# Altium project Kasil_DIOT_x86_board.PrjPcb (part 2 of 4)

## Sheet DualETH_CON.SchDoc
size 420 x 297 mm; SheetNumber: 7; SheetTotal: 11; ModifiedBy: -; CheckedDate: -; Title2: Title 2; DivGrp: WUT ISE; Designer: G.Kasprowicz
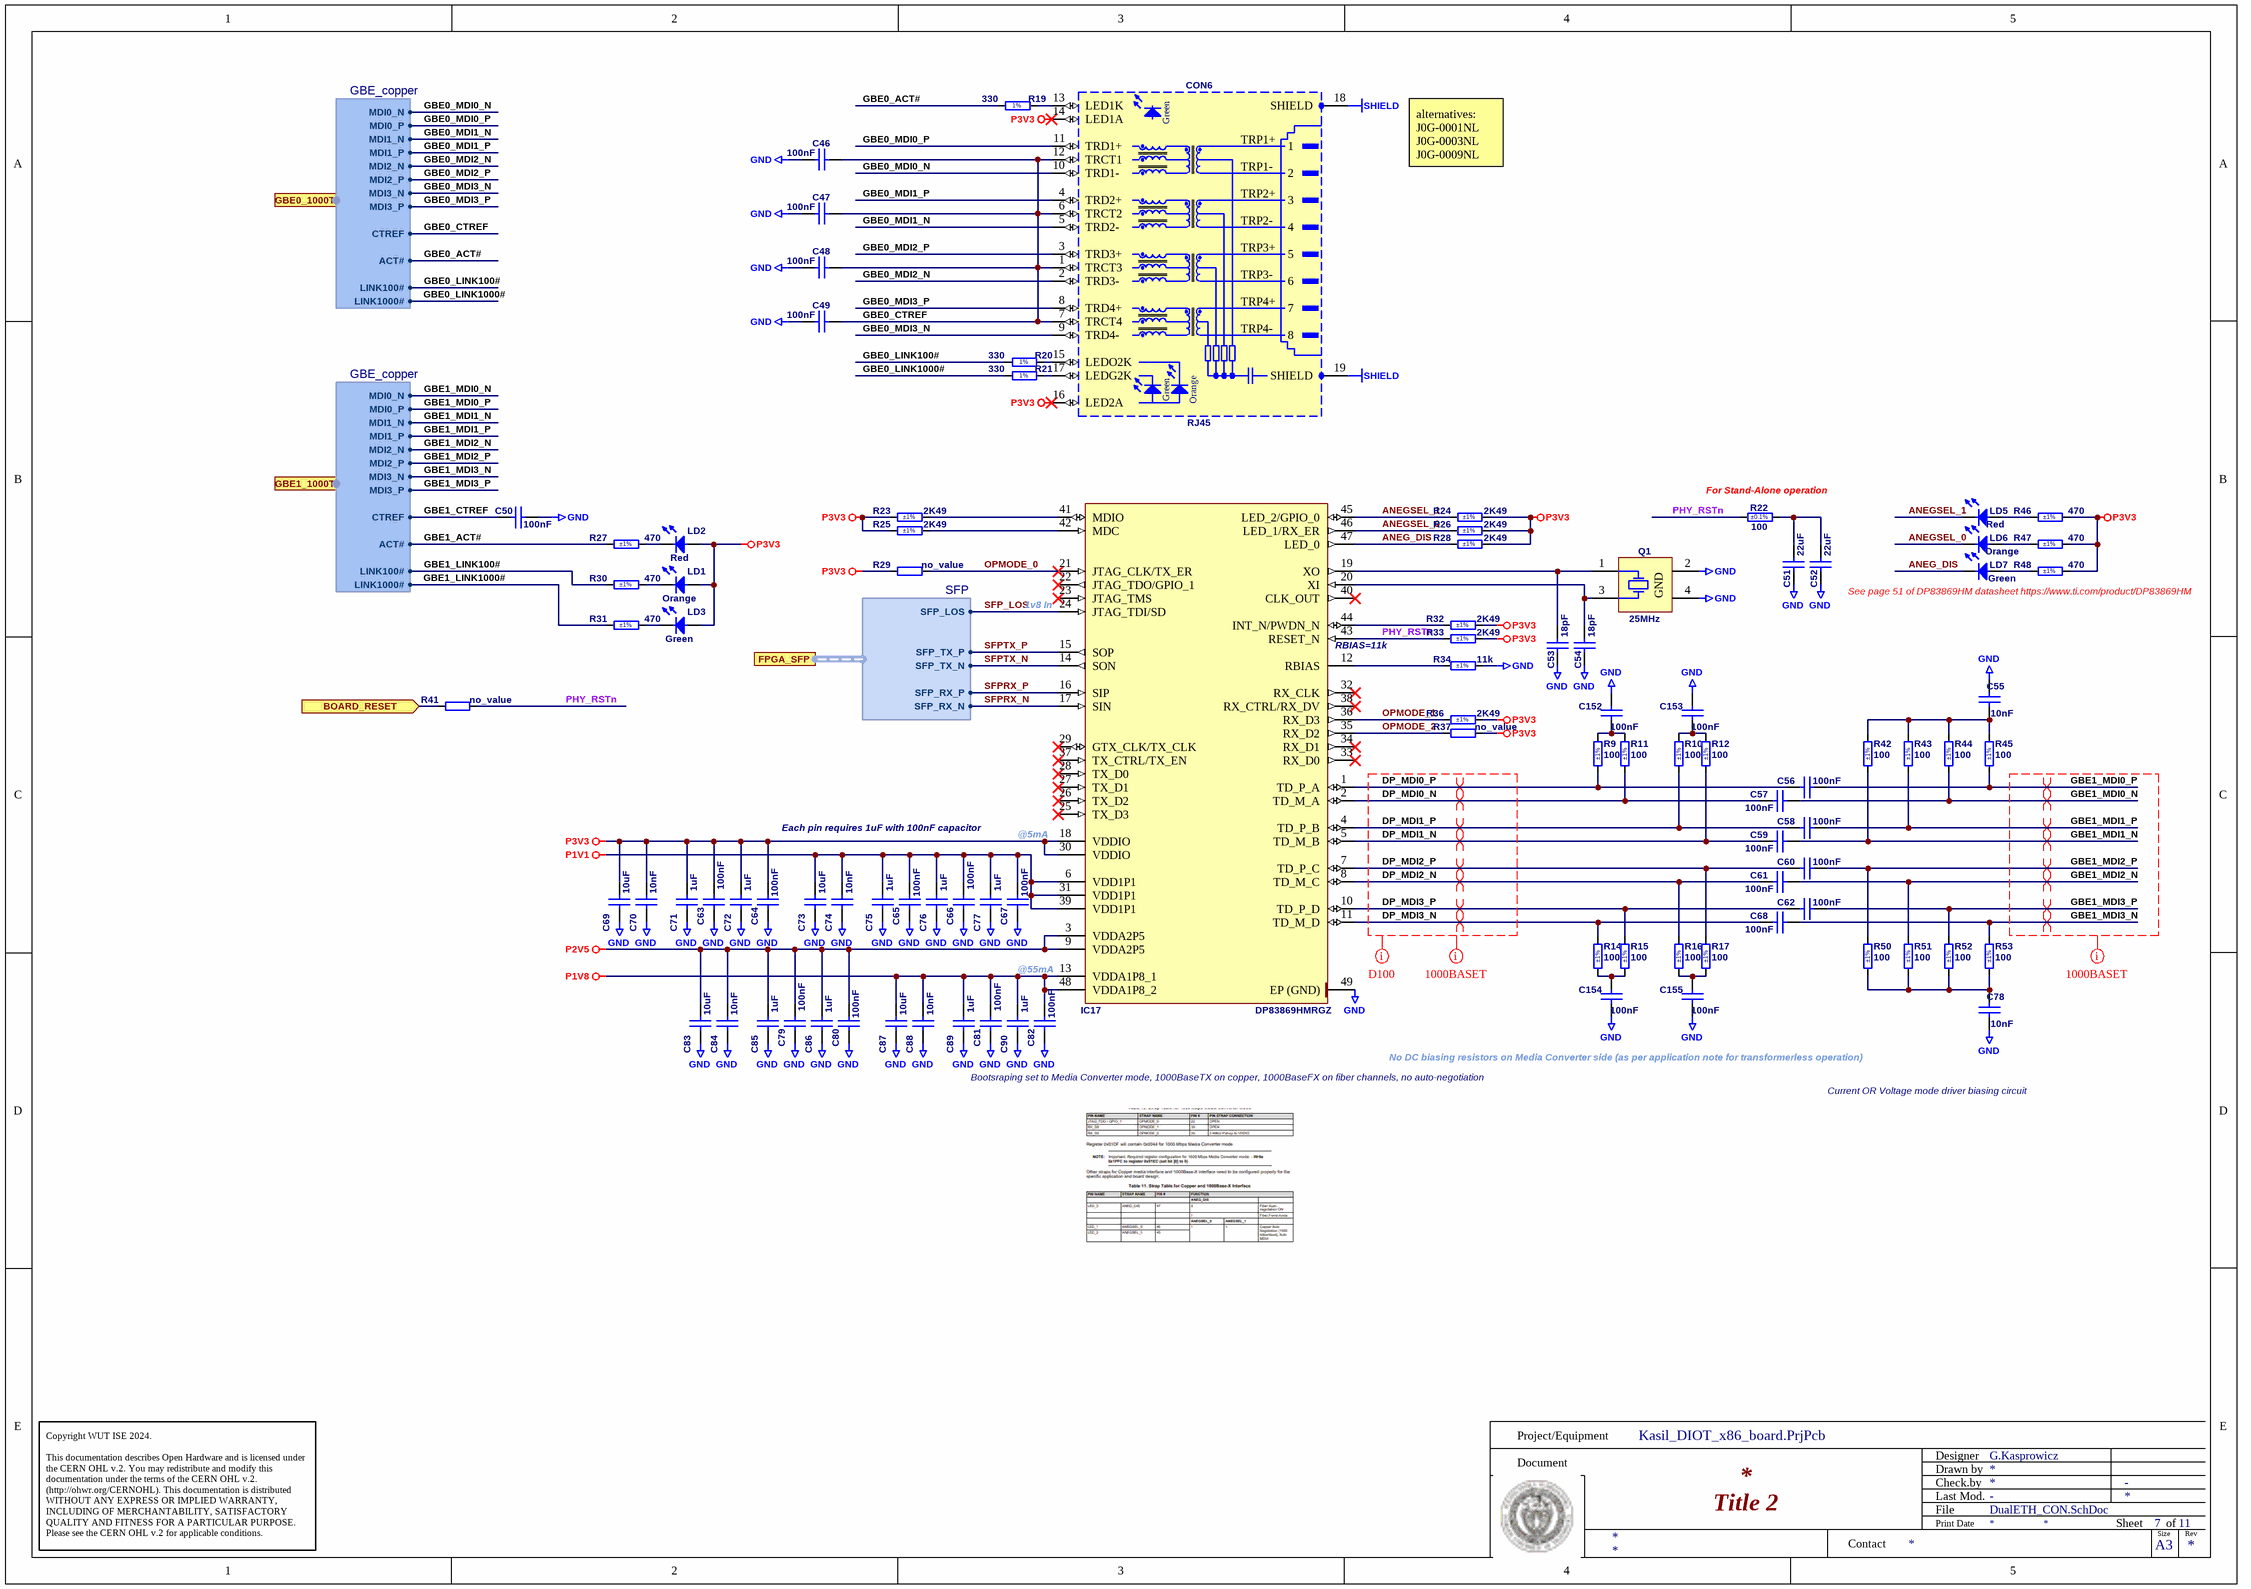
[diagram p3: DualETH_CON.SchDoc]

### Parts
C46  100nF  [CAPC1005X55N]
C47  100nF  [CAPC1005X55N]
C48  100nF  [CAPC1005X55N]
C49  100nF  [CAPC1005X55N]
C50  100nF  [CAPC1005X55N]
C51  22uF  [CAPC2012X135N]
C52  22uF  [CAPC2012X135N]
C53  18pF  [CAPC1005X55N]
C54  18pF  [CAPC1005X55N]
C55  10nF  [CAPC1005X55N]
C56  100nF  [CAPC1005X55N]
C57  100nF  [CAPC1005X55N]
C58  100nF  [CAPC1005X55N]
C59  100nF  [CAPC1005X55N]
C60  100nF  [CAPC1005X55N]
C61  100nF  [CAPC1005X55N]
C62  100nF  [CAPC1005X55N]
C63  100nF  [CAPC1005X55N]
C64  100nF  [CAPC1005X55N]
C65  100nF  [CAPC1005X55N]
C66  100nF  [CAPC1005X55N]
C67  100nF  [CAPC1005X55N]
C68  100nF  [CAPC1005X55N]
C69  10uF  [CAPC1608X80N]
C70  10nF  [CAPC1005X55N]
C71  1uF  [CAPC1005X55N]
C72  1uF  [CAPC1005X55N]
C73  10uF  [CAPC1608X80N]
C74  10nF  [CAPC1005X55N]
C75  1uF  [CAPC1005X55N]
C76  1uF  [CAPC1005X55N]
C77  1uF  [CAPC1005X55N]
C78  10nF  [CAPC1005X55N]
C79  100nF  [CAPC1005X55N]
C80  100nF  [CAPC1005X55N]
C81  100nF  [CAPC1005X55N]
C82  100nF  [CAPC1005X55N]
C83  10uF  [CAPC1608X80N]
C84  10nF  [CAPC1005X55N]
C85  1uF  [CAPC1005X55N]
C86  1uF  [CAPC1005X55N]
C87  10uF  [CAPC1608X80N]
C88  10nF  [CAPC1005X55N]
C89  1uF  [CAPC1005X55N]
C90  1uF  [CAPC1005X55N]
C152  100nF  [CAPC1005X55N]
C153  100nF  [CAPC1005X55N]
C154  100nF  [CAPC1005X55N]
C155  100nF  [CAPC1005X55N]
CON6  RJ45  [BELFUSE_L829-1J1T-43]
IC17  DP83869HMRGZ  [QFN50P700X700X100-49N-S420]
LD1  Orange  [LED_DIALIGHT_597-2111-407F]
LD2  Red  [LED_DIALIGHT_597-2111-407F]
LD3  Green  [LED_DIALIGHT_597-2111-407F]
LD5  Red  [LED_DIALIGHT_597-2111-407F]
LD6  Orange  [LED_DIALIGHT_597-2111-407F]
LD7  Green  [LED_DIALIGHT_597-2111-407F]
Q1  25MHz  [XTAL_EPSON_TSX-3225]
R9  100  Tolerance: ±1%  [RESC1005X40N]
R10  100  Tolerance: ±1%  [RESC1005X40N]
R11  100  Tolerance: ±1%  [RESC1005X40N]
R12  100  Tolerance: ±1%  [RESC1005X40N]
R14  100  Tolerance: ±1%  [RESC1005X40N]
R15  100  Tolerance: ±1%  [RESC1005X40N]
R16  100  Tolerance: ±1%  [RESC1005X40N]
R17  100  Tolerance: ±1%  [RESC1005X40N]
R19  330  [RESC1608X55N]
R20  330  [RESC1608X55N]
R21  330  [RESC1608X55N]
R22  100  Tolerance: ±0.1%  [RESC1005X35N]
R23  2K49  Tolerance: ±1%  [RESC1005X40N]
R24  2K49  Tolerance: ±1%  [RESC1005X40N]
R25  2K49  Tolerance: ±1%  [RESC1005X40N]
R26  2K49  Tolerance: ±1%  [RESC1005X40N]
R27  470  Tolerance: ±1%  [RESC1005X40N]
R28  2K49  Tolerance: ±1%  [RESC1005X40N]
R29  no_value  [RESC1005X40N]  (no BOM)
R30  470  Tolerance: ±1%  [RESC1005X40N]
R31  470  Tolerance: ±1%  [RESC1005X40N]
R32  2K49  Tolerance: ±1%  [RESC1005X40N]
R33  2K49  Tolerance: ±1%  [RESC1005X40N]
R34  11k  Tolerance: ±1%  [RESC1005X40N]
R36  2K49  Tolerance: ±1%  [RESC1005X40N]
R37  no_value  [RESC1005X40N]  (no BOM)
R41  no_value  [RESC1005X40N]  (no BOM)
R42  100  Tolerance: ±1%  [RESC1005X40N]
R43  100  Tolerance: ±1%  [RESC1005X40N]
R44  100  Tolerance: ±1%  [RESC1005X40N]
R45  100  Tolerance: ±1%  [RESC1005X40N]
R46  470  Tolerance: ±1%  [RESC1005X40N]
R47  470  Tolerance: ±1%  [RESC1005X40N]
R48  470  Tolerance: ±1%  [RESC1005X40N]
R50  100  Tolerance: ±1%  [RESC1005X40N]
R51  100  Tolerance: ±1%  [RESC1005X40N]
R52  100  Tolerance: ±1%  [RESC1005X40N]
R53  100  Tolerance: ±1%  [RESC1005X40N]

### Ports
BOARD_RESET (in), FPGA_SFP (harness SFP), GBE0_1000T (harness GBE_copper), GBE1_1000T (harness GBE_copper)

### Harnesses
GBE_copper: MDI2_P, MDI3_N, MDI2_N, MDI3_P, MDI1_P, MDI0_N, MDI1_N, MDI0_P, ACT#, LINK100#, LINK1000#, CTREF
SFP: SFP_TX_P, SFP_TX_N, SFP_RX_P, SFP_RX_N, SFP_LOS

### Nets
GND: C46.1 C47.1 C48.1 C49.1 C50.1 C51.1 C52.1 C53.1 C54.1 C55.2 C63.1 C64.1 C65.1 C66.1 C67.1 C69.1 C70.1 C71.1 C72.1 C73.1 C74.1 C75.1 C76.1 C77.1 C78.1 C79.1 C80.1 C81.1 C82.1 C83.1 C84.1 C85.1 C86.1 C87.1 C88.1 C89.1 C90.1 C152.2 C153.2 C154.1 C155.1 IC17.49(EP_(GND)) Q1.2(GND) Q1.4(GND) R34.2
P1V1: C65.2 C66.2 C67.2 C73.2 C74.2 C75.2 C76.2 C77.2 IC17.6(VDD1P1) IC17.31(VDD1P1) IC17.39(VDD1P1)
P1V8: C81.2 C82.2 C87.2 C88.2 C89.2 C90.2 IC17.13(VDDA1P8_1) IC17.48(VDDA1P8_2)
P2V5: C79.2 C80.2 C83.2 C84.2 C85.2 C86.2 IC17.3(VDDA2P5) IC17.9(VDDA2P5)
P3V3: C63.2 C64.2 C69.2 C70.2 C71.2 C72.2 CON6.14(LED1A) CON6.16(LED2A) IC17.18(VDDIO) IC17.30(VDDIO) LD1.2(A) LD2.2(A) LD3.2(A) R23.1 R24.2 R25.1 R26.2 R28.2 R29.1 R32.2 R33.2 R36.2 R37.2 R46.2 R47.2 R48.2
SHIELD: CON6.18(SHIELD) CON6.19(SHIELD)
BOARD_RESET: R41.1 ; port BOARD_RESET
ANEG_DIS: IC17.47(LED_0) LD7.1(C) R28.1
ANEGSEL_0: IC17.46(LED_1/RX_ER) LD6.1(C) R26.1
ANEGSEL_1: IC17.45(LED_2/GPIO_0) LD5.1(C) R24.1
DP_MDI0_N: C57.1 IC17.2(TD_M_A) R11.1
DP_MDI0_P: C56.1 IC17.1(TD_P_A) R9.1
DP_MDI1_N: C59.1 IC17.5(TD_M_B) R12.1
DP_MDI1_P: C58.1 IC17.4(TD_P_B) R10.1
DP_MDI2_N: C61.1 IC17.8(TD_M_C) R16.2
DP_MDI2_P: C60.1 IC17.7(TD_P_C) R17.2
DP_MDI3_N: C68.1 IC17.11(TD_M_D) R14.2
DP_MDI3_P: C62.1 IC17.10(TD_P_D) R15.2
GBE0_ACT#: R19.1 ; port GBE0_1000T.ACT#
GBE0_CTREF: C46.2 C47.2 C48.2 C49.2 CON6.1(TRCT3) CON6.6(TRCT2) CON6.7(TRCT4) CON6.12(TRCT1) ; port GBE0_1000T.CTREF
GBE0_LINK100#: R20.1 ; port GBE0_1000T.LINK100#
GBE0_LINK1000#: R21.1 ; port GBE0_1000T.LINK1000#
GBE0_MDI0_N: CON6.10(TRD1-) ; port GBE0_1000T.MDI0_N
GBE0_MDI0_P: CON6.11(TRD1+) ; port GBE0_1000T.MDI0_P
GBE0_MDI1_N: CON6.5(TRD2-) ; port GBE0_1000T.MDI1_N
GBE0_MDI1_P: CON6.4(TRD2+) ; port GBE0_1000T.MDI1_P
GBE0_MDI2_N: CON6.2(TRD3-) ; port GBE0_1000T.MDI2_N
GBE0_MDI2_P: CON6.3(TRD3+) ; port GBE0_1000T.MDI2_P
GBE0_MDI3_N: CON6.9(TRD4-) ; port GBE0_1000T.MDI3_N
GBE0_MDI3_P: CON6.8(TRD4+) ; port GBE0_1000T.MDI3_P
GBE1_ACT#: R27.1 ; port GBE1_1000T.ACT#
GBE1_CTREF: C50.2 ; port GBE1_1000T.CTREF
GBE1_LINK100#: R30.1 ; port GBE1_1000T.LINK100#
GBE1_LINK1000#: R31.1 ; port GBE1_1000T.LINK1000#
GBE1_MDI0_N: C57.2 R44.1 ; port GBE1_1000T.MDI0_N
GBE1_MDI0_P: C56.2 R45.1 ; port GBE1_1000T.MDI0_P
GBE1_MDI1_N: C59.2 R42.1 ; port GBE1_1000T.MDI1_N
GBE1_MDI1_P: C58.2 R43.1 ; port GBE1_1000T.MDI1_P
GBE1_MDI2_N: C61.2 R51.2 ; port GBE1_1000T.MDI2_N
GBE1_MDI2_P: C60.2 R50.2 ; port GBE1_1000T.MDI2_P
GBE1_MDI3_N: C68.2 R53.2 ; port GBE1_1000T.MDI3_N
GBE1_MDI3_P: C62.2 R52.2 ; port GBE1_1000T.MDI3_P
OPMODE_0: IC17.21(JTAG_CLK/TX_ER) R29.2
OPMODE_1: IC17.36(RX_D3) R36.1
OPMODE_2: IC17.35(RX_D2) R37.1
PHY_RSTn: IC17.43(RESET_N) R22.1 R33.1 R41.2
SFP_LOS: IC17.24(JTAG_TDI/SD) ; port FPGA_SFP.SFP_LOS
SFPRX_N: IC17.17(SIN) ; port FPGA_SFP.SFP_RX_N
SFPRX_P: IC17.16(SIP) ; port FPGA_SFP.SFP_RX_P
SFPTX_N: IC17.14(SON) ; port FPGA_SFP.SFP_TX_N
SFPTX_P: IC17.15(SOP) ; port FPGA_SFP.SFP_TX_P
NetC51_2: C51.2 C52.2 R22.2
NetC53_2: C53.2 IC17.19(XO) Q1.1(X)
NetC54_2: C54.2 IC17.20(XI) Q1.3(X)
NetC55_1: C55.1 R42.2 R43.2 R44.2 R45.2
NetC78_2: C78.2 R50.1 R51.1 R52.1 R53.1
NetC152_1: C152.1 R9.2 R11.2
NetC153_1: C153.1 R10.2 R12.2
NetC154_2: C154.2 R14.1 R15.1
NetC155_2: C155.2 R16.1 R17.1
NetCON6_13: CON6.13(LED1K) R19.2
NetCON6_15: CON6.15(LEDO2K) R20.2
NetCON6_17: CON6.17(LEDG2K) R21.2
NetIC17_12: IC17.12(RBIAS) R34.1
NetIC17_41: IC17.41(MDIO) R23.2
NetIC17_42: IC17.42(MDC) R25.2
NetIC17_44: IC17.44(INT_N/PWDN_N) R32.1
NetLD1_1: LD1.1(C) R30.2
NetLD2_1: LD2.1(C) R27.2
NetLD3_1: LD3.1(C) R31.2
NetLD5_2: LD5.2(A) R46.1
NetLD6_2: LD6.2(A) R47.1
NetLD7_2: LD7.2(A) R48.1

Not connected (* = marked no-connect by the designer): IC17 22(JTAG_TDO/GPIO_1)* 23(JTAG_TMS)* 25(TX_D3)* 26(TX_D2)* 27(TX_D1)* 28(TX_D0)* 29(GTX_CLK/TX_CLK)* 32(RX_CLK)* 33(RX_D0)* 34(RX_D1)* 37(TX_CTRL/TX_EN)* 38(RX_CTRL/RX_DV)* 40(CLK_OUT)*

### Layout directives
differential pair: DP_MDI0_N, DP_MDI0_P, DP_MDI1_N, DP_MDI1_P, DP_MDI2_N, DP_MDI2_P, DP_MDI3_N, DP_MDI3_P, GBE1_MDI0_N, GBE1_MDI0_P, GBE1_MDI1_N, GBE1_MDI1_P, GBE1_MDI2_N, GBE1_MDI2_P, GBE1_MDI3_N, GBE1_MDI3_P
net class D100: DP_MDI0_N, DP_MDI0_P, DP_MDI1_N, DP_MDI1_P, DP_MDI2_N, DP_MDI2_P, DP_MDI3_N, DP_MDI3_P
net class 1000BASET: DP_MDI0_N, DP_MDI0_P, DP_MDI1_N, DP_MDI1_P, DP_MDI2_N, DP_MDI2_P, DP_MDI3_N, DP_MDI3_P, GBE1_MDI0_N, GBE1_MDI0_P, GBE1_MDI1_N, GBE1_MDI1_P, GBE1_MDI2_N, GBE1_MDI2_P, GBE1_MDI3_N, GBE1_MDI3_P

### Notes on the sheet
- alternatives:
  J0G-0001NL
  J0G-0003NL
  J0G-0009NL
- (near R22) For Stand-Alone operation
- See page 51 of DP83869HM datasheet https://www.ti.com/product/DP83869HM
- (near IC17) 1v8 In
- (near IC17) RBIAS=11k
- Each pin requires 1uF with 100nF capacitor
- @5mA
- @55mA
- No DC biasing resistors on Media Converter side (as per application note for transformerless operation)
- Bootsraping set to Media Converter mode, 1000BaseTX on copper, 1000BaseFX on fiber channels, no auto-negotiation
- Current OR Voltage mode driver biasing circuit
- Project/Equipment
- Document
- Designer
- Drawn by
- Check.by
- Copyright WUT ISE 2024.
  This documentation describes Open Hardware and is licensed under the CERN OHL v.2. You may redistribute and modify this documentation under the terms of the CERN OHL v.2. (http://ohwr.org/CERNOHL). This documentation is distributed WITHOUT ANY EXPRESS OR IMPLIED WARRANTY, INCLUDING OF MERCHANTABILITY, SATISFACTORY QUALITY AND FITNESS FOR A PARTICULAR PURPOSE. Please see the CERN OHL v.2 for applicable conditions.
- Contact
- File
- Last Mod.
- Print Date
- Sheet
- Size
- A3
- of
- Rev
- (in symbol BELFUSE_L829-1J1T-43) Green; TRP1+; TRP1-; TRP2+; TRP2-; TRP3+; TRP3-; TRP4+; TRP4-; Orange
- (in symbol R0603_330R_1%_0.1W_100PPM) 1%

### Library data of the parts
C46-C50 = CC0402_100NF_16V_10%_X7R: Non-polarised capacitor; Part Description: SMD Multilayer Chip Ceramic Capacitor; Manufacturer: GENERIC; Manufacturer1 Part Number: 223878715649; Voltage: 16V; TC: X7R; Tolerance: ±10%; Table: Capacitors SMD; Part Number: CC0402_100NF_16V_10%_X7R; Component Kind: Standard; Component Type: Standard; Pin Count: 2; Value: 100nF; Status: Not Recommended; Manufacturer Part Number: CC0402_100NF_16V_10%_X7R; Case: 0402; Mounted: Yes; Socket: No; SMD: Yes; Manufacturer1 Example: PHYCOMP; Manufacturer1 ComponentHeight: 0.55mm; HelpURL: \\cern.ch\dfs\Applications\Altium\Datasheets\CC0402_X7R_PHYCOMP.pdf; Author: CERN DEM JLC; CreateDate: 2007-12-03; LatestRevisionDate: 2007-12-03
C51 C52 = CC0805_22UF_16V_10%_X5R: Non-polarised capacitor; Manufacturer: GENERIC; Part Description: SMD Multilayer Chip Ceramic Capacitor; Manufacturer1 Part Number: C2012X5R1C226KT; Tolerance: ±10%; Voltage: 16V; TC: X5R; Manufacturer Part Number: CC0805_22UF_16V_10%_X5R; Part Number: CC0805_22UF_16V_10%_X5R; Value: 22uF; Component Kind: Standard; Component Type: Standard; Pin Count: 2; Status: Preferred; Case: 0805; Mounted: Yes; Socket: No; SMD: Yes; Sense: No; Manufacturer1 Example: TDK; Manufacturer1 ComponentHeight: 1.35mm; HelpURL: \\cern.ch\dfs\Applications\Altium\Datasheets\CC0805_X5R_TDK_C.pdf; Author: CERN DEM JLC; CreateDate: 25.10.2012; LatestRevisionDate: 25.10.2012
C53 C54 = CC0402_18PF_50V_5%_C0G: Non-polarised capacitor; Part Description: SMD Multilayer Chip Ceramic Capacitor; Manufacturer: GENERIC; Manufacturer1 Part Number: C0402C180J5GACTU; Voltage: 50V; TC: C0G/NP0; Tolerance: ±5%; Part Number: CC0402_18PF_50V_5%_C0G; Component Kind: Standard; Component Type: Standard; Pin Count: 2; Value: 18pF; Status: Preferred; Manufacturer Part Number: CC0402_18PF_50V_5%_C0G; Case: 0402; Mounted: Yes; Socket: No; SMD: Yes; Sense: No; Manufacturer1 Example: KEMET; Manufacturer1 ComponentHeight: 0.55mm; HelpURL: \\cern.ch\dfs\Applications\Altium\Datasheets\CC0402_C0G_KEMET_(Commercial Grade).pdf; Author: CERN DEM JLC; CreateDate: 04.10.2016; LatestRevisionDate: 04.10.2016
C55 C70 C74 C78 C84 C88 = CC0402_10NF_16V_10%_X7R: Non-polarised capacitor; Part Description: SMD Multilayer Chip Ceramic Capacitor; Manufacturer: GENERIC; Manufacturer1 Part Number: 223878715636; Voltage: 16V; TC: X7R; Tolerance: ±10%; Part Number: CC0402_10NF_16V_10%_X7R; Component Kind: Standard; Component Type: Standard; Pin Count: 2; Value: 10nF; Status: Not Recommended; Manufacturer Part Number: CC0402_10NF_16V_10%_X7R; Case: 0402; Mounted: Yes; Socket: No; SMD: Yes; Sense: No; Manufacturer1 Example: PHYCOMP; Manufacturer1 ComponentHeight: 0.55mm; HelpURL: \\cern.ch\dfs\Applications\Altium\Datasheets\CC0402_X7R_PHYCOMP.pdf; Author: CERN DEM JLC; CreateDate: 03.12.2007; LatestRevisionDate: 03.12.2007
C56-C68 C79-C82 C152-C155 = CC0402_100NF_16V_10%_X7R: Non-polarised capacitor; Part Description: SMD Multilayer Chip Ceramic Capacitor; Manufacturer: GENERIC; Manufacturer1 Part Number: GRM155R71C104KA88D; Voltage: 16V; TC: X7R; Tolerance: ±10%; Part Number: CC0402_100NF_16V_10%_X7R; Component Kind: Standard; Component Type: Standard; Pin Count: 2; Value: 100nF; Status: Not Recommended; Manufacturer Part Number: CC0402_100NF_16V_10%_X7R; Case: 0402; Mounted: Yes; Socket: No; SMD: Yes; Sense: No; Manufacturer1 Example: MURATA; Manufacturer1 ComponentHeight: 0.55mm; HelpURL: \\cern.ch\dfs\Applications\Altium\Datasheets\CC0402_X7R_MURATA_GRM.pdf; Author: CERN DEM JLC; CreateDate: 05/12/2013; LatestRevisionDate: 03/12/2007
C69 C73 C83 C87 = CC0603_10UF_16V_20%_X5R: Non-polarised capacitor; Part Description: SMD Multilayer Chip Ceramic Capacitor; Manufacturer: GENERIC; Manufacturer1 Part Number: GRM188R61C106MA73D; Voltage: 16V; TC: X5R; Tolerance: ±20%; Part Number: CC0603_10UF_16V_20%_X5R; Component Kind: Standard; Component Type: Standard; Pin Count: 2; Value: 10uF; Status: None; Manufacturer Part Number: CC0603_10UF_16V_20%_X5R; Case: 0603; Mounted: Yes; Socket: No; SMD: Yes; Sense: No; Manufacturer1 Example: MURATA; Manufacturer1 ComponentHeight: 0.8mm; HelpURL: \\cern.ch\dfs\Applications\Altium\Datasheets\CC0603_X5R_MURATA_GRM.pdf; Author: CERN DEM MR; CreateDate: 02.03.2016; LatestRevisionDate: 02.03.2016
C71 C72 C75-C77 C85 C86 C89 C90 = CC0402_1UF_16V_10%_X5R: Non-polarised capacitor; Part Description: SMD Multilayer Chip Ceramic Capacitor; Manufacturer: GENERIC; Manufacturer1 Part Number: C1005X5R1C105KT; Voltage: 16V; TC: X5R; Tolerance: ±10%; Part Number: CC0402_1UF_16V_10%_X5R; Component Kind: Standard; Component Type: Standard; Pin Count: 2; Value: 1uF; Status: Preferred; Manufacturer Part Number: CC0402_1UF_16V_10%_X5R; Case: 0402; Mounted: Yes; Socket: No; SMD: Yes; Sense: No; Manufacturer1 Example: TDK; Manufacturer1 ComponentHeight: 0.55mm; HelpURL: \\cern.ch\dfs\Applications\Altium\Datasheets\CC0402_X5R_TDK_C.pdf; Author: CERN DEM JLC; CreateDate: 2012-10-25; LatestRevisionDate: 2012-10-25
CON6 = BELFUSE_L829-1J1T-43: 1 Port, RJ45, Gigabit Ethernet, MagJack Connector Module With Yellow And Green/Orange LEDs,; Part Description: 1 Port, Yellow/ Green-Yellow LEDs,  RJ45 10/100/1000 Gigabit Ethernet, MagJack® Connector Module; Table: Miscellaneous; Part Number: BELFUSE_L829-1J1T-43; Component Kind: Standard; Component Type: Standard; Pin Count: 19; Family: RJ45; Mounted: Yes; Socket: No; SMD: No; Status: None; Manufacturer: BELFUSE; Manufacturer Part Number: L829-1J1T-43; ComponentHeight: 13.3mm; HelpURL: \\cern.ch\dfs\Applications\Altium\Datasheets\BELFUSE_L829-1J1T-43.pdf; Author: CERN DEM JLC; CreateDate: 2011-08-22; LatestRevisionDate: 2012-04-12
IC17 = DP83869HMRGZ: DP83869HM High Immunity 10/100/1000 Ethernet Physical Layer Transceiver WithCopper and Fiber Interface; Manufacturer: TEXAS INSTRUMENTS; PressFit: No; Bonding: No; Part Number: DP83869HMRGZ; Component Kind: Standard; Component Type: Standard; Device: DP83869HMRGZ; PackageDescription: QFN, 0.50mm Pitch, Square; 48 Pin, 7.00mm L X 7.00mm W X 1.00mm H body (w/Thermal Tab 4.20 X 4.20mm), IPC Medium Density; Part Description: High Immunity 10/100/1000 Ethernet Physical Layer Transceiver with Copper and Fiber Interface; Manufacturer Part Number: DP83869HMRGZ; Pin Count: 48; Case: QFN48; Mounted: Yes; Socket: No; SMD: Yes; Sense: No; ComponentHeight: 1mm; Author: CERN DEM HF; HelpURL: \\cern.ch\dfs\Applications\Altium\Datasheets\DP83869HMRGZ.pdf; CreateDate: 24.04.2024; LatestRevisionDate: 24.04.2024
LD1 LD6 = LED_DIALIGHT_597-2111-407F: https://www.mouser.pl/ProductDetail/Kingbright/APA3010SECK-GX?qs=sGAEpiMZZMt82OzCyDsLFKA61kPckac5U%252BKMX0q8m8Q%3D; Part Description: Right Angle SMT GaAIAs Red LED, 597 Series; PressFit: No; Bonding: No; Part Number: LED_DIALIGHT_597-2111-407F; Component Kind: Standard; Component Type: Standard; Color: Orange; PackageDescription: SMT GaAlAs Red LED, Body 3x2mm (1208),  DIALIGHT 597 Series; Manufacturer: DIALIGHT; Manufacturer Part Number: 597-2111-407F; Pin Count: 3; Case: 1208; Mounted: Yes; Socket: No; SMD: Yes; Sense: No; ComponentHeight: 1mm; HelpURL: \\cern.ch\dfs\Applications\Altium\Datasheets\LED_DIALIGHT_597-2111-407F.pdf; Author: CERN DEM JMW; CreateDate: 14.09.2015; LatestRevisionDate: 14.09.2015
LD2 LD5 = LED_DIALIGHT_597-2111-407F: https://www.mouser.pl/ProductDetail/Kingbright/APA3010EC-GX?qs=sGAEpiMZZMt82OzCyDsLFDW2r6KyqONY2QQPZo8KS1I%3D; Part Description: Right Angle SMT GaAIAs Red LED, 597 Series; PressFit: No; Bonding: No; Part Number: LED_DIALIGHT_597-2111-407F; Component Kind: Standard; Component Type: Standard; Color: Red; PackageDescription: SMT GaAlAs Red LED, Body 3x2mm (1208),  DIALIGHT 597 Series; Manufacturer: DIALIGHT; Manufacturer Part Number: 597-2111-407F; Pin Count: 3; Case: 1208; Mounted: Yes; Socket: No; SMD: Yes; Sense: No; ComponentHeight: 1mm; HelpURL: \\cern.ch\dfs\Applications\Altium\Datasheets\LED_DIALIGHT_597-2111-407F.pdf; Author: CERN DEM JMW; CreateDate: 14.09.2015; LatestRevisionDate: 14.09.2015
LD3 LD7 = LED_DIALIGHT_597-2111-407F: https://www.mouser.pl/ProductDetail/Kingbright/APA3010SGC-GX?qs=sGAEpiMZZMt82OzCyDsLFOTeXJMTPP2t8pkIn112vkg%3D; Part Description: Right Angle SMT GaAIAs Red LED, 597 Series; PressFit: No; Bonding: No; Part Number: LED_DIALIGHT_597-2111-407F; Component Kind: Standard; Component Type: Standard; Color: Green; PackageDescription: SMT GaAlAs Red LED, Body 3x2mm (1208),  DIALIGHT 597 Series; Manufacturer: DIALIGHT; Manufacturer Part Number: 597-2111-407F; Pin Count: 3; Case: 1208; Mounted: Yes; Socket: No; SMD: Yes; Sense: No; ComponentHeight: 1mm; HelpURL: \\cern.ch\dfs\Applications\Altium\Datasheets\LED_DIALIGHT_597-2111-407F.pdf; Author: CERN DEM JMW; CreateDate: 14.09.2015; LatestRevisionDate: 14.09.2015
Q1 = XTAL_25MHZ_EPSON_TSX-3225 25.0000MF10Z-AC: Crystal 4 pins 1=XTAL Control 2=GND3=XTAL 4=GND; Part Description: Tolerance: ±10ppm,  Stability:±10ppm, -20°C to 75°C, 9pF, Surface Mount Quartz Crystal, TX-3225 Series; Manufacturer: EPSON; PressFit: No; Bonding: No; Part Number: XTAL_25MHZ_EPSON_TSX-3225 25.0000MF10Z-AC; Component Kind: Standard; Component Type: Standard; PackageDescription: Crystal, Corner Concave; 4 Pin, 2.50mm L X 3.20mm W X 0.6mm H, TSX-3225 Serie; Value: 25MHz; Manufacturer Part Number: TSX-3225 25.0000MF10Z-AC; Pin Count: 4; Mounted: Yes; Socket: No; SMD: Yes; Sense: No; ComponentHeight: 0.6mm; HelpURL: \\cern.ch\dfs\Applications\Altium\Datasheets\XTAL_EPSON_TSX-3225.pdf; ComponentLink1URL: \\cern.ch\dfs\Applications\Altium\Datasheets\XTAL_EPSON_TSX-3225_Ordering-Informations.pdf; ComponentLink1Description: Ordering Informations; Author: CERN DEM JLC; CreateDate: 03.04.2012; LatestRevisionDate: 06.10.2016
R9-R12 R14-R17 R42-R45 R50-R53 = R0402_100R_1%_0.0625W_100PPM: Resistor - 1%; Part Description: General Purpose Thick Film Chip Resistor; Manufacturer: GENERIC; Manufacturer1 Part Number: 232270671001L; TC: ±100ppm/°C; PressFit: No; Part Number: R0402_100R_1%_0.0625W_100PPM; Component Kind: Standard; Component Type: Standard; Pin Count: 2; Value: 100; Status: Not Recommended; Power: 0.0625W; Manufacturer Part Number: R0402_100R_1%_0.0625W_100PPM; Case: 0402; Mounted: Yes; Sense: No; Socket: No; SMD: Yes; Manufacturer1 Example: YAGEO PHYCOMP; Manufacturer1 ComponentHeight: 0.4mm; HelpURL: \\cern.ch\dfs\Applications\Altium\Datasheets\R0402_Phycomp_RC0402.pdf; Author: CERN DEM JLC; CreateDate: 03.12.2007; LatestRevisionDate: 17.10.2012
R19-R21 = R0603_330R_1%_0.1W_100PPM: Resistor - 1%; Part Description: General Purpose Thick Film Chip Resistor; Manufacturer: GENERIC; Manufacturer1 Part Number: NRC06F3300TRF; Power: 0.1W; TC: ±100ppm/°C; Table: Resistors SMD; Part Number: R0603_330R_1%_0.1W_100PPM; Component Kind: Standard; Component Type: Standard; Pin Count: 2; Value: 330; Status: Preferred; Tolerance: ±1%; Manufacturer Part Number: R0603_330R_1%_0.1W_100PPM; Case: 0603; Mounted: Yes; Socket: No; SMD: Yes; Manufacturer1 Example: NIC COMPONENT; Manufacturer1 ComponentHeight: 0.55mm; HelpURL: \\cern.ch\dfs\Applications\Altium\Datasheets\R0603_NIC_NRC.pdf; Author: CERN DEM JLC; CreateDate: 2007-12-03; LatestRevisionDate: 2008-03-13
R22 = R0402_100R_0.1%_0.063W_25PPM: Resistor - 0.1%; Part Description: Thin Film Precision Resistor; Manufacturer: GENERIC; Manufacturer1 Part Number: CPF0402B100RE1; Power: 0.063W; TC: ±25ppm/°C; PressFit: No; Part Number: R0402_100R_0.1%_0.063W_25PPM; Component Kind: Standard; Component Type: Standard; Pin Count: 2; Value: 100; Status: Not Recommended; Manufacturer Part Number: R0402_100R_0.1%_0.063W_25PPM; Case: 0402; Mounted: Yes; Sense: No; Socket: No; SMD: Yes; Manufacturer1 Example: TE CONNECTIVITY; Manufacturer1 ComponentHeight: 0.35mm; HelpURL: \\cern.ch\dfs\Applications\Altium\Datasheets\R0402_TYCO_CPF.pdf; Author: CERN DEM JMW; CreateDate: 22.09.2015; LatestRevisionDate: 22.09.2015
R23-R26 R28 R32 R33 R36 = R0402_2K49_1%_0.063W_100PPM: Resistor - 1%; Part Description: General Purpose Thick Film Chip Resistor; Manufacturer: GENERIC; Manufacturer1 Part Number: CRCW04022K49FK; Power: 0.063W; TC: ±100ppm/°C; PressFit: No; Part Number: R0402_2K49_1%_0.063W_100PPM; Component Kind: Standard; Component Type: Standard; Pin Count: 2; Value: 2K49; Status: None; Manufacturer Part Number: R0402_2K49_1%_0.063W_100PPM; Case: 0402; Mounted: Yes; Sense: No; Socket: No; SMD: Yes; Manufacturer1 Example: VISHAY; Manufacturer1 ComponentHeight: 0.4mm; HelpURL: \\cern.ch\dfs\Applications\Altium\Datasheets\R0402_VISHAY_CRCW e3.pdf; Author: CERN DEM BC; CreateDate: 10.01.2020; LatestRevisionDate: 10.01.2020
R27 R30 R31 R46-R48 = R0402_470R_1%_0.0625W_100PPM: Resistor - 1%; Part Description: General Purpose Thick Film Chip Resistor; Manufacturer: GENERIC; Manufacturer1 Part Number: 232270674701L; TC: ±100ppm/°C; PressFit: No; Part Number: R0402_470R_1%_0.0625W_100PPM; Component Kind: Standard; Component Type: Standard; Pin Count: 2; Value: 470; Status: Not Recommended; Power: 0.0625W; Manufacturer Part Number: R0402_470R_1%_0.0625W_100PPM; Case: 0402; Mounted: Yes; Sense: No; Socket: No; SMD: Yes; Manufacturer1 Example: YAGEO PHYCOMP; Manufacturer1 ComponentHeight: 0.4mm; HelpURL: \\cern.ch\dfs\Applications\Altium\Datasheets\R0402_Phycomp_RC0402.pdf; Author: CERN DEM JLC; CreateDate: 03.12.2007; LatestRevisionDate: 17.10.2012
R29 R37 R41 = R0402_0R_JUMPER: Resistor; Part Description: 1A (0.05R Max DC Resistance) Zero Ohm Jumper; Manufacturer: GENERIC; Manufacturer1 Part Number: 232270591001L; PressFit: No; Part Number: R0402_0R_JUMPER; Component Type: Standard; Pin Count: 2; Value: no_value; Status: Not Recommended; Manufacturer Part Number: R0402_0R_JUMPER; Case: 0402; Mounted: Yes; Sense: No; Socket: No; SMD: Yes; Manufacturer1 Example: YAGEO PHYCOMP; Manufacturer1 ComponentHeight: 0.4mm; HelpURL: \\cern.ch\dfs\Applications\Altium\Datasheets\R0402_Phycomp_RC0402.pdf; Author: CERN DEM JLC; CreateDate: 03.12.2007; LatestRevisionDate: 17.10.2012
R34 = R0402_11K_1%_0.0625W_100PPM: Resistor - 1%; Part Description: General Purpose Thick Film Chip Resistor; Manufacturer: GENERIC; Manufacturer1 Part Number: 232270671103L; TC: ±100ppm/°C; PressFit: No; Part Number: R0402_11K_1%_0.0625W_100PPM; Component Kind: Standard; Component Type: Standard; Pin Count: 2; Value: 11k; Status: Not Recommended; Power: 0.0625W; Manufacturer Part Number: R0402_11K_1%_0.0625W_100PPM; Case: 0402; Mounted: Yes; Sense: No; Socket: No; SMD: Yes; Manufacturer1 Example: YAGEO PHYCOMP; Manufacturer1 ComponentHeight: 0.4mm; HelpURL: \\cern.ch\dfs\Applications\Altium\Datasheets\R0402_Phycomp_RC0402.pdf; Author: CERN DEM JLC; CreateDate: 03.12.2007; LatestRevisionDate: 17.10.2012

## Sheet DualUSB2.0_CON.SchDoc
size 420 x 297 mm; SheetNumber: 5; SheetTotal: 11; ModifiedBy: -; CheckedDate: -; Title2: Title 2; DivGrp: WUT ISE; Designer: G.Kasprowicz
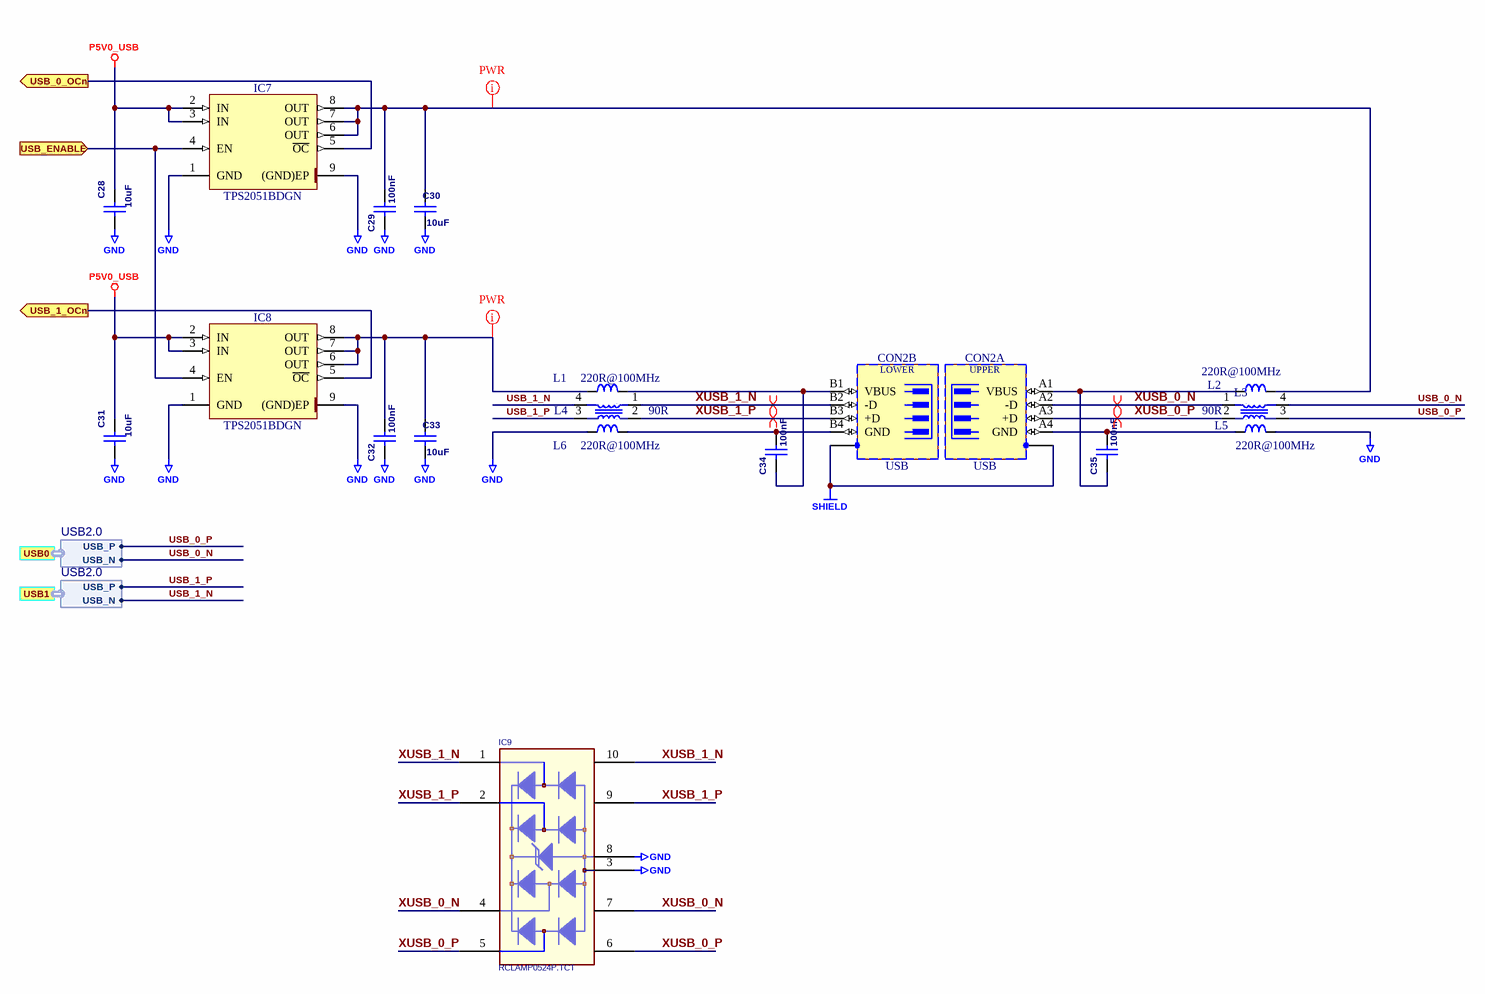
[diagram p4: DualUSB2.0_CON.SchDoc]

### Parts
C28  10uF  [CAPC2012X135N]
C29  100nF  [CAPC1005X55N]
C30  10uF  [CAPC2012X135N]
C31  10uF  [CAPC2012X135N]
C32  100nF  [CAPC1005X55N]
C33  10uF  [CAPC2012X135N]
C34  100nF  [CAPC1005X55N]
C35  100nF  [CAPC1005X55N]
CON2  USB  [FCI_72309-8034BLF]  (parts A,B of 2)
IC7  TPS2051BDGN  [SOP65P490X110-9N-R157X189]
IC8  TPS2051BDGN  [SOP65P490X110-9N-R157X189]
IC9  RCLAMP0524P.TCT  [SMDARRAYC_10P4C]
L1  220R@100MHz  [INDC2012X105N]
L2  220R@100MHz  [INDC2012X105N]
L3  value 90R  [DLSCM0805]  (hidden comment: DLSCM0805-900M or DLW21SN900SQ2L)
L4  value 90R  [DLSCM0805]  (hidden comment: DLSCM0805-900M or DLW21SN900SQ2L)
L5  220R@100MHz  [INDC2012X105N]
L6  220R@100MHz  [INDC2012X105N]

### Ports
USB0 (harness USB2.0), USB1 (harness USB2.0), USB_0_OCn (out), USB_1_OCn (out), USB_ENABLE (in)

### Harnesses
USB2.0: USB_P, USB_N

### Nets
GND: C28.1 C29.1 C30.1 C31.1 C32.1 C33.1 IC7.1(GND) IC7.9((GND)EP) IC8.1(GND) IC8.9((GND)EP) IC9.3 IC9.8 L5.2 L6.1
P5V0_USB: C28.2 C31.2 IC7.2(IN) IC7.3(IN) IC8.2(IN) IC8.3(IN)
SHIELD: CON2.SH(SHIELD)
CARRIER_PWRON: IC7.4(EN) IC8.4(EN) ; port USB_ENABLE
USB_0_N: L3.4 ; port USB0.USB_N
USB_0_OCn: IC7.5(~{OC}) ; port USB_0_OCn
USB_0_P: L3.3 ; port USB0.USB_P
USB_1_N: L4.4 ; port USB1.USB_N
USB_1_OCn: IC8.5(~{OC}) ; port USB_1_OCn
USB_1_P: L4.3 ; port USB1.USB_P
XUSB_0_N: CON2.A2(-D) IC9.4 IC9.7 L3.1
XUSB_0_P: CON2.A3(+D) IC9.5 IC9.6 L3.2
XUSB_1_N: CON2.B2(-D) IC9.1 IC9.10 L4.1
XUSB_1_P: CON2.B3(+D) IC9.2 IC9.9 L4.2
NetC29_2: C29.2 C30.2 IC7.6(OUT) IC7.7(OUT) IC7.8(OUT) L2.2
NetC32_2: C32.2 C33.2 IC8.6(OUT) IC8.7(OUT) IC8.8(OUT) L1.1
NetC34_1: C34.1 CON2.B1(VBUS) L1.2
NetC34_2: C34.2 CON2.B4(GND) L6.2
NetC35_1: C35.1 CON2.A1(VBUS) L2.1
NetC35_2: C35.2 CON2.A4(GND) L5.1

### Layout directives
differential pair: XUSB_0_N, XUSB_0_P, XUSB_1_N, XUSB_1_P
net class PWR: NetC29_2, NetC32_2

### Notes on the sheet
- Project/Equipment
- Document
- Designer
- Drawn by
- Check.by
- Copyright WUT ISE 2024.
  This documentation describes Open Hardware and is licensed under the CERN OHL v.2. You may redistribute and modify this documentation under the terms of the CERN OHL v.2. (http://ohwr.org/CERNOHL). This documentation is distributed WITHOUT ANY EXPRESS OR IMPLIED WARRANTY, INCLUDING OF MERCHANTABILITY, SATISFACTORY QUALITY AND FITNESS FOR A PARTICULAR PURPOSE. Please see the CERN OHL v.2 for applicable conditions.
- Contact
- File
- Last Mod.
- Print Date
- Sheet
- Size
- A3
- of
- Rev
- (in symbol FCI_72309-8034BLF, part A) UPPER
- (in symbol FCI_72309-8034BLF, part B) LOWER

### Library data of the parts
C28 C30 C31 C33 = CC0805_10UF_10V_10%_X7R: Non-polarised capacitor; Part Description: SMD Multilayer Chip Ceramic Capacitor; Manufacturer: GENERIC; Manufacturer1 Part Number: GRM21BR71A106KE51L; Voltage: 10V; TC: X7R; Tolerance: ±10%; Table: Capacitors SMD; Part Number: CC0805_10UF_10V_10%_X7R; Component Kind: Standard; Component Type: Standard; Pin Count: 2; Value: 10uF; Status: Preferred; Manufacturer Part Number: CC0805_10UF_10V_10%_X7R; Case: 0805; Mounted: Yes; Socket: No; SMD: Yes; Manufacturer1 Example: MURATA; Manufacturer1 ComponentHeight: 1.35mm; HelpURL: \\cern.ch\dfs\Applications\Altium\Datasheets\CC0805_X7R_MURATA.pdf; Author: CERN DEM JLC; CreateDate: 2012-04-30; LatestRevisionDate: 2012-04-30
C29 C32 C34 C35 = CC0402_100NF_16V_10%_X7R: as C56 on sheet DualETH_CON; Part Number: CC0402_100NF_16V_10%_X7R; Component Kind: Standard; Component Type: Standard; Pin Count: 2; Value: 100nF; Status: Not Recommended; Manufacturer Part Number: CC0402_100NF_16V_10%_X7R; Case: 0402; Mounted: Yes; Socket: No; SMD: Yes; Sense: No; Manufacturer1 Example: MURATA; Manufacturer1 ComponentHeight: 0.55mm; HelpURL: \\cern.ch\dfs\Applications\Altium\Datasheets\CC0402_X7R_MURATA_GRM.pdf; Author: CERN DEM JLC; CreateDate: 05/12/2013; LatestRevisionDate: 03/12/2007
CON2 = FCI_72309-8034BLF: Dual 4 Pin + 1 Shield USB Receptacle; Part Description: Dual Right Angle USB Type A Receptacle, Through Hole, 30u GXT Contact, 8 Pins, Shield With Bright Tin Plating, 1.57 mm PCB, White HSG; Manufacturer: FCI; Part Number: FCI_72309-8034BLF; Component Kind: Standard; Component Type: Standard; Pin Count: 9; Family: USB; Mounted: Yes; Socket: No; SMD: No; Status: None; Manufacturer Part Number: 72309-8034BLF; ComponentHeight: 15.5mm; HelpURL: \\cern.ch\dfs\Applications\Altium\Datasheets\FCI_72309-8034BLF.pdf; Author: CERN DEM JLC; CreateDate: 2011-03-23; LatestRevisionDate: 2011-03-23; Table: FCI
IC7 IC8 = TPS2051BDGN: One Channel, Current-Limited, Power-Distribution Switches; Part Description: One Channel, Current-Limited (500mA), Power-Distribution Switches; Manufacturer: TEXAS INSTRUMENTS; PressFit: No; Bonding: No; Part Number: TPS2051BDGN; Component Kind: Standard; Component Type: Standard; Device: TPS2051BDGN; PackageDescription: SOP, 0.65mm Pitch; 8 Pin, 3.00mm W X 3.00mm L X 1.10mm H body (w/Thermal Tab 1.57 X 1.89mm), IPC Medium Density; Manufacturer Part Number: TPS2051BDGN; Pin Count: 8; Case: SSOP8; Mounted: Yes; Socket: No; SMD: Yes; Sense: No; ComponentHeight: 1.1mm; Author: CERN DEM BC; HelpURL: \\cern.ch\dfs\Applications\Altium\Datasheets\TPS2051BDGN.pdf; CreateDate: 06.07.2020; LatestRevisionDate: 06.07.2020
IC9 = D_TVS_RCLAMP0524P: DIODE,RCLAMP0524P,SEMTECH; Specification: SMD,ESD COMPONENT,ROHS
L1 L2 L5 L6 = IND0805_MURATA_BLM21PG221SN1D: Inductor; Part Description: SMD EMIFIL Suppression Chip Ferrite Bead; Manufacturer: MURATA; Power: 2A; Resistance: 0.05R; Tolerance: ±25%; Table: Inductors SMD; Part Number: IND0805_MURATA_BLM21PG221SN1D; Component Kind: Standard; Component Type: Standard; Pin Count: 2; Value: 220R@100MHz; Status: None; Manufacturer Part Number: BLM21PG221SN1D; Case: 0805; Mounted: Yes; Socket: No; SMD: Yes; ComponentHeight: 1.05mm; HelpURL: \\cern.ch\dfs\Applications\Altium\Datasheets\IND0402_MURATA_BLM21P.pdf; Author: CERN DEM JLC; CreateDate: 2010-01-25; LatestRevisionDate: 2010-01-25
L3 L4 = L_CMC_DLSCM0805_90R: Common Mode Choke 90R

## Sheet DualUSB3.0_CON.SchDoc
size 420 x 297 mm; SheetNumber: 6; SheetTotal: 11; ModifiedBy: -; CheckedDate: -; Title2: Title 2; DivGrp: WUT ISE; Designer: G.Kasprowicz
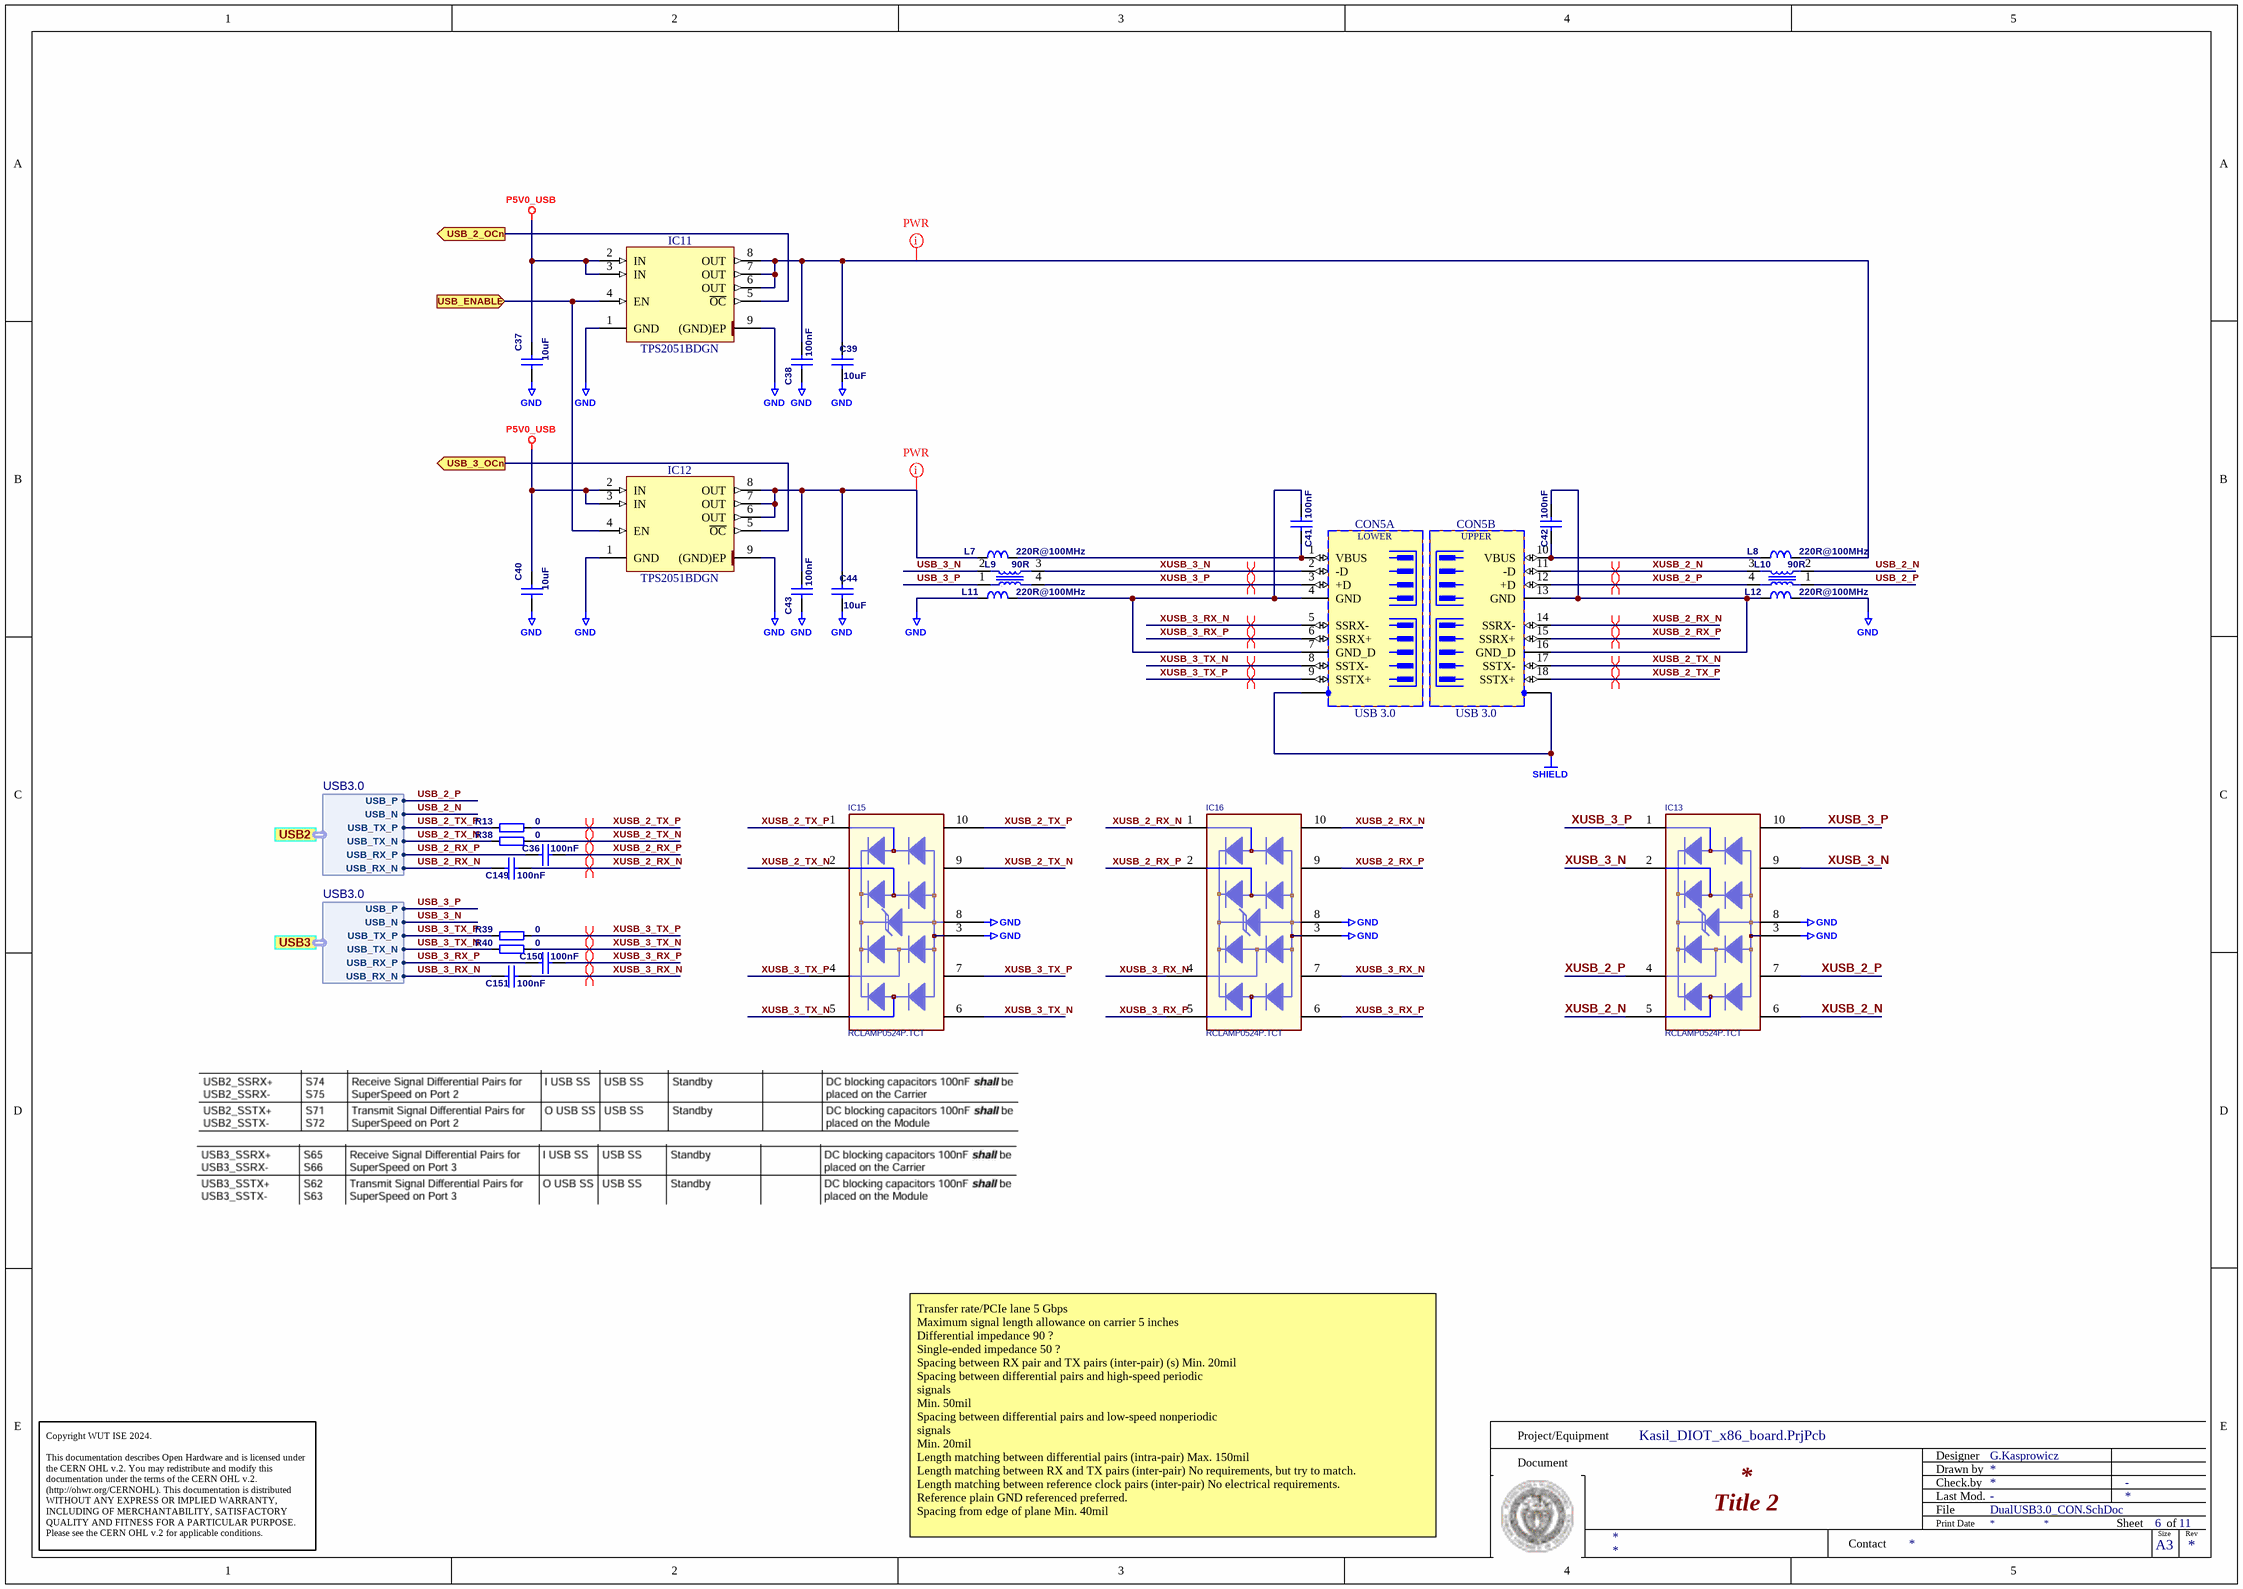
[diagram p5: DualUSB3.0_CON.SchDoc]

### Parts
C36  100nF  [CAPC1005X55N]
C37  10uF  [CAPC2012X135N]
C38  100nF  [CAPC1005X55N]
C39  10uF  [CAPC2012X135N]
C40  10uF  [CAPC2012X135N]
C41  100nF  [CAPC1005X55N]
C42  100nF  [CAPC1005X55N]
C43  100nF  [CAPC1005X55N]
C44  10uF  [CAPC2012X135N]
C149  100nF  [CAPC1005X55N]
C150  100nF  [CAPC1005X55N]
C151  100nF  [CAPC1005X55N]
CON5  USB 3.0  [WURTH_692141030100]  (parts A,B of 2)
IC11  TPS2051BDGN  [SOP65P490X110-9N-R157X189]
IC12  TPS2051BDGN  [SOP65P490X110-9N-R157X189]
IC13  RCLAMP0524P.TCT  [SMDARRAYC_10P4C]
IC15  RCLAMP0524P.TCT  [SMDARRAYC_10P4C]
IC16  RCLAMP0524P.TCT  [SMDARRAYC_10P4C]
L7  220R@100MHz  [INDC2012X105N]
L8  220R@100MHz  [INDC2012X105N]
L9  value 90R  [DLSCM0805]  (hidden comment: DLSCM0805-900M or DLW21SN900SQ2L)
L10  value 90R  [DLSCM0805]  (hidden comment: DLSCM0805-900M or DLW21SN900SQ2L)
L11  220R@100MHz  [INDC2012X105N]
L12  220R@100MHz  [INDC2012X105N]
R13  0  [RESC1005X40N]
R38  0  [RESC1005X40N]
R39  0  [RESC1005X40N]
R40  0  [RESC1005X40N]

### Ports
USB2 (harness USB3.0), USB3 (harness USB3.0), USB_2_OCn (out), USB_3_OCn (out), USB_ENABLE (in)

### Harnesses
USB3.0: USB_P, USB_N, USB_TX_P, USB_TX_N, USB_RX_P, USB_RX_N

### Nets
GND: C37.1 C38.1 C39.1 C40.1 C43.1 C44.1 IC11.1(GND) IC11.9((GND)EP) IC12.1(GND) IC12.9((GND)EP) IC13.3 IC13.8 IC15.3 IC15.8 IC16.3 IC16.8 L11.1 L12.2
P5V0_USB: C37.2 C40.2 IC11.2(IN) IC11.3(IN) IC12.2(IN) IC12.3(IN)
SHIELD: CON5.19(SHIELD) CON5.20(SHIELD)
CARRIER_PWRON: IC11.4(EN) IC12.4(EN) ; port USB_ENABLE
USB_2_N: L10.2 ; port USB2.USB_N
USB_2_OCn: IC11.5(~{OC}) ; port USB_2_OCn
USB_2_P: L10.1 ; port USB2.USB_P
USB_2_RX_N: C149.1 ; port USB2.USB_RX_N
USB_2_RX_P: C36.1 ; port USB2.USB_RX_P
USB_2_TX_N: R38.1 ; port USB2.USB_TX_N
USB_2_TX_P: R13.1 ; port USB2.USB_TX_P
USB_3_N: L9.2 ; port USB3.USB_N
USB_3_OCn: IC12.5(~{OC}) ; port USB_3_OCn
USB_3_P: L9.1 ; port USB3.USB_P
USB_3_RX_N: C151.1 ; port USB3.USB_RX_N
USB_3_RX_P: C150.1 ; port USB3.USB_RX_P
USB_3_TX_N: R40.1 ; port USB3.USB_TX_N
USB_3_TX_P: R39.1 ; port USB3.USB_TX_P
XUSB_2_N: CON5.11(-D) IC13.5 IC13.6 L10.3
XUSB_2_P: CON5.12(+D) IC13.4 IC13.7 L10.4
XUSB_2_RX_N: C149.2 CON5.14(SSRX-) IC16.1 IC16.10
XUSB_2_RX_P: C36.2 CON5.15(SSRX+) IC16.2 IC16.9
XUSB_2_TX_N: CON5.17(SSTX-) IC15.2 IC15.9 R38.2
XUSB_2_TX_P: CON5.18(SSTX+) IC15.1 IC15.10 R13.2
XUSB_3_N: CON5.2(-D) IC13.2 IC13.9 L9.3
XUSB_3_P: CON5.3(+D) IC13.1 IC13.10 L9.4
XUSB_3_RX_N: C151.2 CON5.5(SSRX-) IC16.4 IC16.7
XUSB_3_RX_P: C150.2 CON5.6(SSRX+) IC16.5 IC16.6
XUSB_3_TX_N: CON5.8(SSTX-) IC15.5 IC15.6 R40.2
XUSB_3_TX_P: CON5.9(SSTX+) IC15.4 IC15.7 R39.2
NetC38_2: C38.2 C39.2 IC11.6(OUT) IC11.7(OUT) IC11.8(OUT) L8.2
NetC41_1: C41.1 CON5.1(VBUS) L7.2
NetC41_2: C41.2 CON5.4(GND) CON5.7(GND_D) L11.2
NetC42_1: C42.1 CON5.10(VBUS) L8.1
NetC42_2: C42.2 CON5.13(GND) CON5.16(GND_D) L12.1
NetC43_2: C43.2 C44.2 IC12.6(OUT) IC12.7(OUT) IC12.8(OUT) L7.1

### Layout directives
differential pair: XUSB_2_N, XUSB_2_P, XUSB_2_RX_N, XUSB_2_RX_P, XUSB_2_TX_N, XUSB_2_TX_P, XUSB_3_N, XUSB_3_P, XUSB_3_RX_N, XUSB_3_RX_P, XUSB_3_TX_N, XUSB_3_TX_P
net class PWR: NetC38_2, NetC43_2

### Notes on the sheet
- Transfer rate/PCIe lane 5 Gbps
  Maximum signal length allowance on carrier 5 inches
  Differential impedance 90 ?
  Single-ended impedance 50 ?
  Spacing between RX pair and TX pairs (inter-pair) (s) Min. 20mil
  Spacing between differential pairs and high-speed periodic
  signals
  Min. 50mil
  Spacing between differential pairs and low-speed nonperiodic
  signals
  Min. 20mil
  Length matching between differential pairs (intra-pair) Max. 150mil
  Length matching between RX and TX pairs (inter-pair) No requirements, but try to match.
  Length matching between reference clock pairs (inter-pair) No electrical requirements.
  Reference plain GND referenced preferred.
  Spacing from edge of plane Min. 40mil
- Project/Equipment
- Document
- Designer
- Drawn by
- Check.by
- Copyright WUT ISE 2024.
  This documentation describes Open Hardware and is licensed under the CERN OHL v.2. You may redistribute and modify this documentation under the terms of the CERN OHL v.2. (http://ohwr.org/CERNOHL). This documentation is distributed WITHOUT ANY EXPRESS OR IMPLIED WARRANTY, INCLUDING OF MERCHANTABILITY, SATISFACTORY QUALITY AND FITNESS FOR A PARTICULAR PURPOSE. Please see the CERN OHL v.2 for applicable conditions.
- Contact
- File
- Last Mod.
- Print Date
- Sheet
- Size
- A3
- of
- Rev
- (in symbol WURTH_692141030100, part A) LOWER
- (in symbol WURTH_692141030100, part B) UPPER

### Library data of the parts
C36 C38 C41-C43 C149-C151 = CC0402_100NF_16V_10%_X7R: as C56 on sheet DualETH_CON; Part Number: CC0402_100NF_16V_10%_X7R; Component Kind: Standard; Component Type: Standard; Pin Count: 2; Value: 100nF; Status: Not Recommended; Manufacturer Part Number: CC0402_100NF_16V_10%_X7R; Case: 0402; Mounted: Yes; Socket: No; SMD: Yes; Sense: No; Manufacturer1 Example: MURATA; Manufacturer1 ComponentHeight: 0.55mm; HelpURL: \\cern.ch\dfs\Applications\Altium\Datasheets\CC0402_X7R_MURATA_GRM.pdf; Author: CERN DEM JLC; CreateDate: 05/12/2013; LatestRevisionDate: 03/12/2007
C37 C39 C40 C44 = CC0805_10UF_10V_10%_X7R: as C28 on sheet DualUSB2.0_CON; Part Number: CC0805_10UF_10V_10%_X7R; Component Kind: Standard; Component Type: Standard; Pin Count: 2; Value: 10uF; Status: Preferred; Manufacturer Part Number: CC0805_10UF_10V_10%_X7R; Case: 0805; Mounted: Yes; Socket: No; SMD: Yes; Manufacturer1 Example: MURATA; Manufacturer1 ComponentHeight: 1.35mm; HelpURL: \\cern.ch\dfs\Applications\Altium\Datasheets\CC0805_X7R_MURATA.pdf; Author: CERN DEM JLC; CreateDate: 2012-04-30; LatestRevisionDate: 2012-04-30
CON5 = WURTH_692141030100: 2x9 Pin + 1 Shield  Duals USB 3.0 Type A Receptacle; Part Description: USB 3.0 Type A Stacked Right Angle Receptacles; Manufacturer: WURTH ELEKTRONIK; Table: Miscellaneous; Part Number: WURTH_692141030100; Component Kind: Standard; Component Type: Standard; Pin Count: 19; Family: USB 3.0; Mounted: Yes; Socket: No; SMD: No; Status: None; Manufacturer Part Number: 692141030100; ComponentHeight: 16.11mm; HelpURL: \\cern.ch\dfs\Applications\Altium\Datasheets\WURTH_692141030100.pdf; Author: CERN DEM JLC; CreateDate: 2013-06-27; LatestRevisionDate: 2013-06-27
IC11 IC12 = TPS2051BDGN: as IC7 on sheet DualUSB2.0_CON; Part Number: TPS2051BDGN; Component Kind: Standard; Component Type: Standard; Device: TPS2051BDGN; PackageDescription: SOP, 0.65mm Pitch; 8 Pin, 3.00mm W X 3.00mm L X 1.10mm H body (w/Thermal Tab 1.57 X 1.89mm), IPC Medium Density; Manufacturer Part Number: TPS2051BDGN; Pin Count: 8; Case: SSOP8; Mounted: Yes; Socket: No; SMD: Yes; Sense: No; ComponentHeight: 1.1mm; Author: CERN DEM BC; HelpURL: \\cern.ch\dfs\Applications\Altium\Datasheets\TPS2051BDGN.pdf; CreateDate: 06.07.2020; LatestRevisionDate: 06.07.2020
IC13 IC15 IC16 = D_TVS_RCLAMP0524P: as IC9 on sheet DualUSB2.0_CON
L7 L8 L11 L12 = IND0805_MURATA_BLM21PG221SN1D: as L1 on sheet DualUSB2.0_CON; Part Number: IND0805_MURATA_BLM21PG221SN1D; Component Kind: Standard; Component Type: Standard; Pin Count: 2; Value: 220R@100MHz; Status: None; Manufacturer Part Number: BLM21PG221SN1D; Case: 0805; Mounted: Yes; Socket: No; SMD: Yes; ComponentHeight: 1.05mm; HelpURL: \\cern.ch\dfs\Applications\Altium\Datasheets\IND0402_MURATA_BLM21P.pdf; Author: CERN DEM JLC; CreateDate: 2010-01-25; LatestRevisionDate: 2010-01-25
L9 L10 = L_CMC_DLSCM0805_90R: Common Mode Choke 90R
R13 R38-R40 = R0402_0R_JUMPER: as R29 on sheet DualETH_CON; Part Number: R0402_0R_JUMPER; Component Kind: Standard; Component Type: Standard; Pin Count: 2; Value: 0; Status: Not Recommended; Manufacturer Part Number: R0402_0R_JUMPER; Case: 0402; Mounted: Yes; Sense: No; Socket: No; SMD: Yes; Manufacturer1 Example: YAGEO PHYCOMP; Manufacturer1 ComponentHeight: 0.4mm; HelpURL: \\cern.ch\dfs\Applications\Altium\Datasheets\R0402_Phycomp_RC0402.pdf; Author: CERN DEM JLC; CreateDate: 03.12.2007; LatestRevisionDate: 17.10.2012